# EAGLE design Circuit_Schematicv2 (EAGLE 8.1.0)
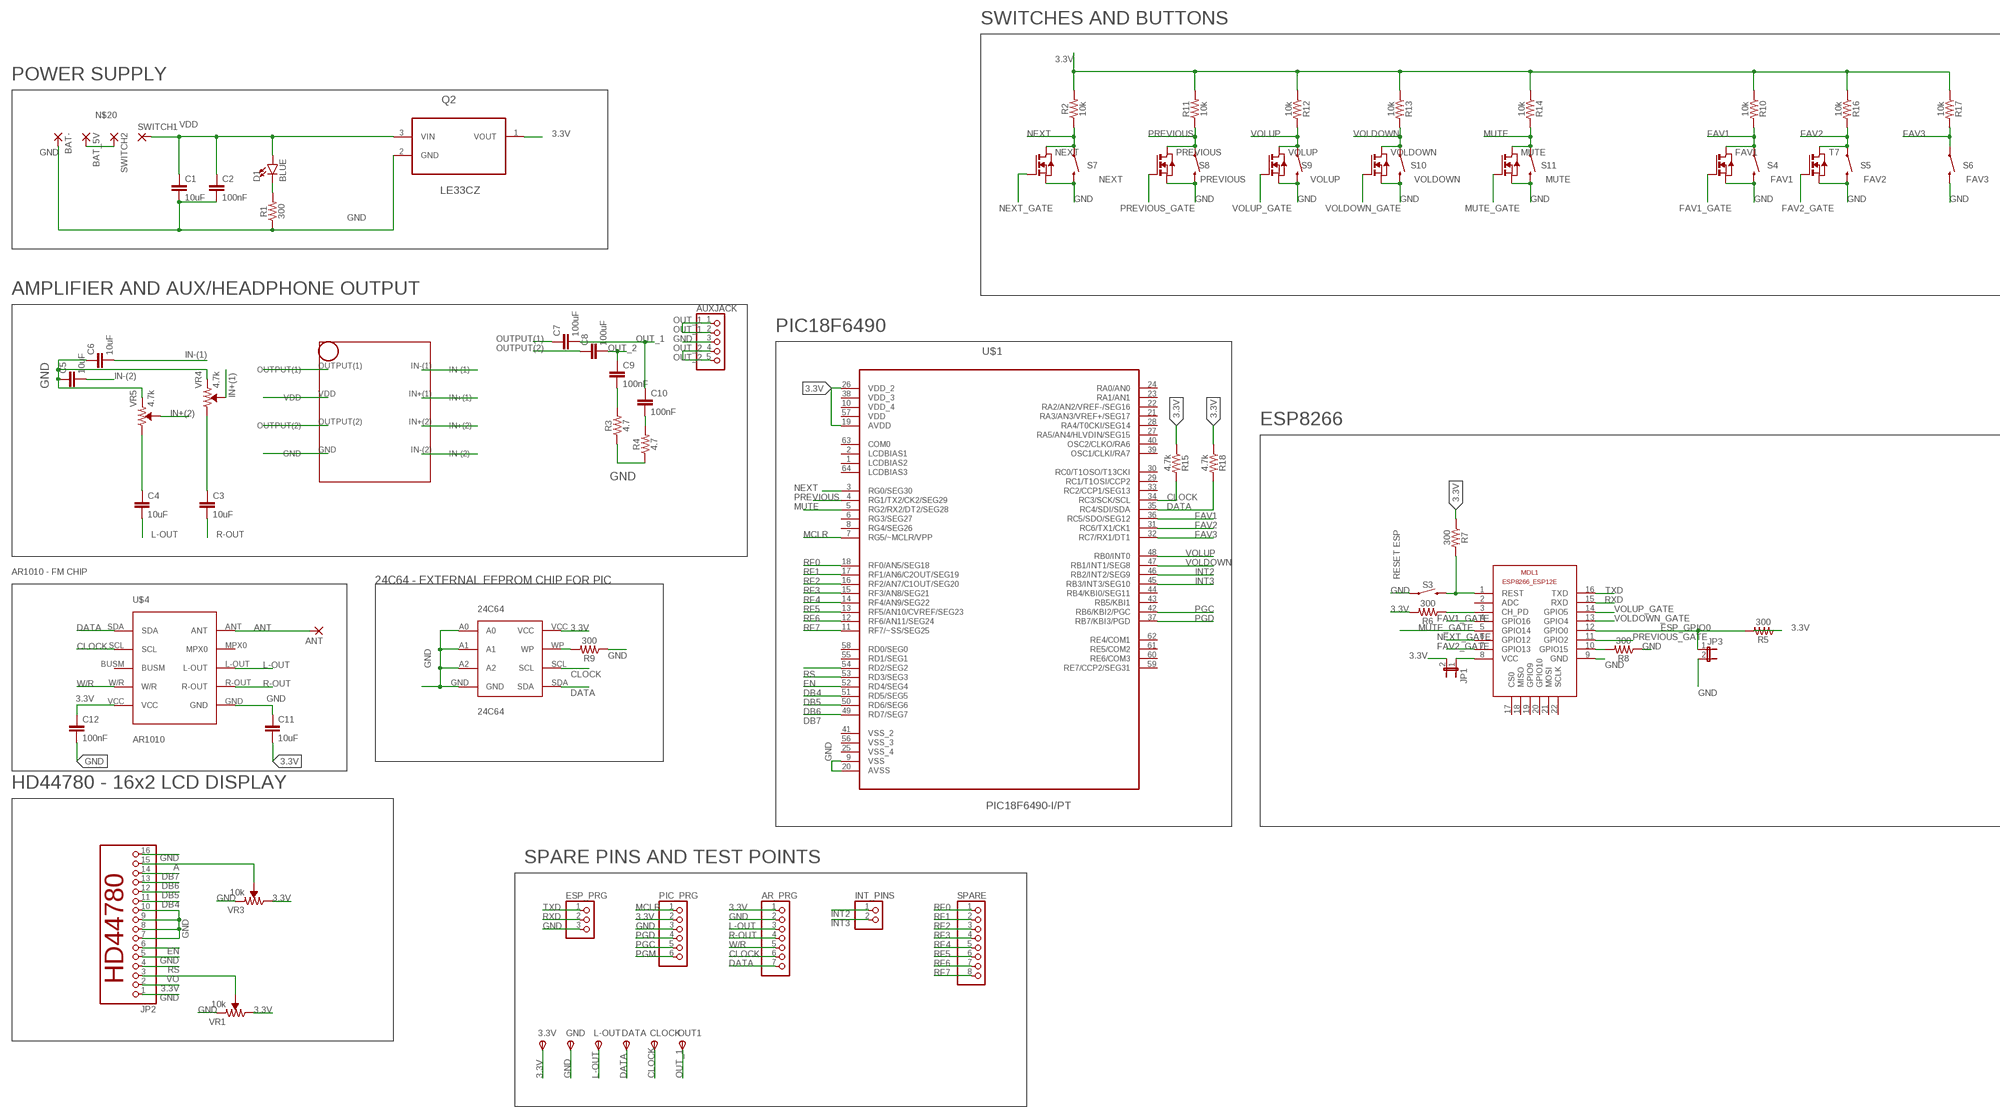
[diagram p0: schematic, sheet 1, part 1 of 2]
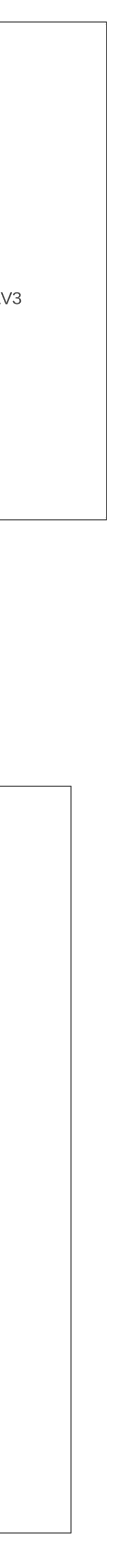
[diagram p1: schematic, sheet 1, part 2 of 2]

## Parts
3.3V  TPSPAD1-13  [P1-13]
24C64  24C64  [SOIC-8]
ANT  2,15/1,0  [2,15/1,0]
AR_PRG  PINHD-1X7  [1X07]
AUXJACK  PINHD-1X5  [1X05]
BAT-  2,15/1,0  [2,15/1,0]
BAT_5V  2,15/1,0  [2,15/1,0]
C1  10uF  10UF-1210-50V-20%  [1210]
C2  100nF  10UF-1210-50V-20%  [1210]
C3  10uF  10UF-1210-50V-20%  [1210]
C4  10uF  10UF-1210-50V-20%  [1210]
C5  10uF  10UF-1210-50V-20%  [1210]
C6  10uF  10UF-1210-50V-20%  [1210]
C7  100uF  10UF-1210-50V-20%  [1210]
C8  100uF  10UF-1210-50V-20%  [1210]
C9  100nF  10UF-1210-50V-20%  [1210]
C10  100nF  10UF-1210-50V-20%  [1210]
C11  10uF  10UF-1210-50V-20%  [1210]
C12  100nF  10UF-1210-50V-20%  [1210]
CLOCK  TPSPAD1-13  [P1-13]
D1  BLUE  LED-BLUE1206  [LED-1206]
DATA  TPSPAD1-13  [P1-13]
ESP_PRG  PINHD-1X3  [1X03]
FAV1  NMOSSOT223  [SOT223]
GND  TPSPAD1-13  [P1-13]
INT_PINS  PINHD-1X2  [1X02]
JP1  JP1E  [JP1]
JP2  LCD16X2HEADER  [LCD16X2HEADER]
JP3  JP1E  [JP1]
L-OUT  TPSPAD1-13  [P1-13]
MDL1  ESP8266-12EESP8266-ESP12E  [ESP8266-ESP12E]
MUTE  NMOSSOT223  [SOT223]
NEXT  NMOSSOT223  [SOT223]
OUT1  TPSPAD1-13  [P1-13]
PIC_PRG  PINHD-1X6  [1X06]
PREVIOUS  NMOSSOT223  [SOT223]
Q2  LE33CZ  [TO127P254X749-3]
R1  300  1OHM-0603-1/10W-1%  [0603]
R2  10k  10KOHM-0603-1/10W-1%  [0603]
R3  4.7  1OHM-0603-1/10W-1%  [0603]
R4  4.7  1OHM-0603-1/10W-1%  [0603]
R5  300  1OHM-0603-1/10W-1%  [0603]
R6  300  1OHM-0603-1/10W-1%  [0603]
R7  300  1OHM-0603-1/10W-1%  [0603]
R8  300  1OHM-0603-1/10W-1%  [0603]
R9  300  1OHM-0603-1/10W-1%  [0603]
R10  10k  10KOHM-0603-1/10W-1%  [0603]
R11  10k  10KOHM-0603-1/10W-1%  [0603]
R12  10k  10KOHM-0603-1/10W-1%  [0603]
R13  10k  10KOHM-0603-1/10W-1%  [0603]
R14  10k  10KOHM-0603-1/10W-1%  [0603]
R15  4.7k  1OHM-0603-1/10W-1%  [0603]
R16  10k  10KOHM-0603-1/10W-1%  [0603]
R17  10k  10KOHM-0603-1/10W-1%  [0603]
R18  4.7k  1OHM-0603-1/10W-1%  [0603]
S3  RESET ESP  MOMENTARY-SWITCH-SPST-SMD-6.0X3.5MM  [TACTILE_SWITCH_SMD_6.0X3.5MM]
S4  FAV1  MOMENTARY-SWITCH-SPST-PTH-6.0MM-KIT  [TACTILE_SWITCH_PTH_6.0MM_KIT]
S5  FAV2  MOMENTARY-SWITCH-SPST-PTH-6.0MM-KIT  [TACTILE_SWITCH_PTH_6.0MM_KIT]
S6  FAV3  MOMENTARY-SWITCH-SPST-PTH-6.0MM-KIT  [TACTILE_SWITCH_PTH_6.0MM_KIT]
S7  NEXT  MOMENTARY-SWITCH-SPST-PTH-6.0MM-KIT  [TACTILE_SWITCH_PTH_6.0MM_KIT]
S8  PREVIOUS  MOMENTARY-SWITCH-SPST-PTH-6.0MM-KIT  [TACTILE_SWITCH_PTH_6.0MM_KIT]
S9  VOLUP  MOMENTARY-SWITCH-SPST-PTH-6.0MM-KIT  [TACTILE_SWITCH_PTH_6.0MM_KIT]
S10  VOLDOWN  MOMENTARY-SWITCH-SPST-PTH-6.0MM-KIT  [TACTILE_SWITCH_PTH_6.0MM_KIT]
S11  MUTE  MOMENTARY-SWITCH-SPST-PTH-6.0MM-KIT  [TACTILE_SWITCH_PTH_6.0MM_KIT]
SPARE  PINHD-1X8  [1X08]
SWITCH1  2,15/1,0  [2,15/1,0]
SWITCH2  2,15/1,0  [2,15/1,0]
T7  NMOSSOT223  [SOT223]
U$1  PIC18F6490-I/PT  [QFP50P1200X1200X120-64N]
U$2  TDA2822M  [TDA2822M]
U$4  AR1010  [AR1010]
VOLDOWN  NMOSSOT223  [SOT223]
VOLUP  NMOSSOT223  [SOT223]
VR1  10k  TRIMPOT-SMD-3MM-OPEN-1/10W-25%  [TRIMPOT-SMD-TC33X]
VR3  10k  TRIMPOT-SMD-3MM-OPEN-1/10W-25%  [TRIMPOT-SMD-TC33X]
VR4  4.7k  TRIMPOT-SMD-3MM-OPEN-1/10W-25%  [TRIMPOT-SMD-TC33X]
VR5  4.7k  TRIMPOT-SMD-3MM-OPEN-1/10W-25%  [TRIMPOT-SMD-TC33X]

## Nets
3.3V: 3.3V.TP(PP) 24C64.VCC AR_PRG.1 C11.2 C12.1 JP1.2 JP2.2 PIC_PRG.2 Q2.1(VOUT) R2.2 R5.1 R6.2 R7.1 R10.1 R11.2 R12.1 R13.1 R14.1 R15.1 R16.1 R17.1 R18.1 U$1.19(AVDD) U$1.26(VDD_2) U$4.VCC VR1.1(CW) VR3.1(CW)
A: JP2.15 VR3.2(WIPER)
ANT: ANT.1(P) U$4.ANT
CH_PD: MDL1.3(CH_PD) R6.1
CLOCK: 24C64.SCL AR_PRG.6 CLOCK.TP(PP) R15.2 U$1.34(RC3/SCK/SCL) U$4.SCL
DATA: 24C64.SDA AR_PRG.7 DATA.TP(PP) R18.2 U$1.35(RC4/SDI/SDA) U$4.SDA
DB4: JP2.11 U$1.52(RD4/SEG4)
DB5: JP2.12 U$1.51(RD5/SEG5)
DB6: JP2.13 U$1.50(RD6/SEG6)
DB7: JP2.14 U$1.49(RD7/SEG7)
EN: JP2.6 U$1.53(RD3/SEG3)
ESP_GPIO0: JP3.1 MDL1.12(GPIO0) R5.2
ESP_VCC: JP1.1 MDL1.8(VCC)
FAV1: FAV1.2(D) FAV1.4(D) R10.2 S4.1 U$1.36(RC5/SDO/SEG12)
FAV1_GATE: FAV1.1(G) MDL1.4(GPIO16)
FAV2: R16.2 S5.1 T7.2(D) T7.4(D) U$1.31(RC6/TX1/CK1)
FAV2_GATE: MDL1.7(GPIO13) T7.1(G)
FAV3: R17.2 S6.1 U$1.32(RC7/RX1/DT1)
GND: 24C64.A0 24C64.A1 24C64.A2 24C64.GND AR_PRG.2 AUXJACK.3 BAT-.1(P) C1.2 C2.2 C5.1 C6.1 C11.1 C12.2 ESP_PRG.3 FAV1.3(S) GND.TP(PP) JP2.1 JP2.5 JP2.7 JP2.8 JP2.9 JP2.10 JP2.16 JP3.2 MDL1.9(GND) MUTE.3(S) NEXT.3(S) PIC_PRG.3 PREVIOUS.3(S) Q2.2(GND) R1.1 R3.1 R4.1 R8.1 R9.1 S3.1 S4.3 S5.3 S6.3 S7.3 S8.3 S9.3 S10.3 S11.3 T7.3(S) U$1.9(VSS) U$1.20(AVSS) U$2.GND U$4.GND VOLDOWN.3(S) VOLUP.3(S) VR1.3(CCW) VR3.3(CCW) VR4.3(CCW) VR5.3(CCW)
IN+(1): U$2.IN+(1) VR4.2(WIPER)
IN+(2): U$2.IN+(2) VR5.2(WIPER)
IN-(1): C6.2 U$2.IN-(1)
IN-(2): C5.2 U$2.IN-(2)
INT2: INT_PINS.1 U$1.46(RB2/INT2/SEG9)
INT3: INT_PINS.2 U$1.45(RB3/INT3/SEG10)
L-OUT: AR_PRG.3 C4.2 L-OUT.TP(PP) U$4.L-OUT
MCLR: PIC_PRG.1 U$1.7(RG5/~MCLR/VPP)
MUTE: MUTE.2(D) MUTE.4(D) R14.2 S11.1 U$1.5(RG2/RX2/DT2/SEG28)
MUTE_GATE: MDL1.5(GPIO14) MUTE.1(G)
N$6: C10.2 R4.2
N$10: 24C64.WP R9.2
N$11: C4.1 VR5.1(CW)
N$12: C3.1 VR4.1(CW)
N$17: C9.2 R3.2
N$18: D1.C R1.2
N$20: BAT_5V.1(P) SWITCH2.1(P)
N$24: MDL1.10(GPIO15) R8.2
NEXT: NEXT.2(D) NEXT.4(D) R2.1 S7.1 U$1.3(RG0/SEG30)
NEXT_GATE: MDL1.6(GPIO12) NEXT.1(G)
OUT_1: AUXJACK.1 AUXJACK.2 C7.2 C10.1 OUT1.TP(PP)
OUT_2: AUXJACK.4 AUXJACK.5 C8.2 C9.1
OUTPUT(1): C7.1 U$2.OUTPUT(1)
OUTPUT(2): C8.1 U$2.OUTPUT(2)
PGC: PIC_PRG.5 U$1.42(RB6/KBI2/PGC)
PGD: PIC_PRG.4 U$1.37(RB7/KBI3/PGD)
PGM: PIC_PRG.6
PREVIOUS: PREVIOUS.2(D) PREVIOUS.4(D) R11.1 S8.1 U$1.4(RG1/TX2/CK2/SEG29)
PREVIOUS_GATE: MDL1.11(GPIO2) PREVIOUS.1(G)
R-OUT: AR_PRG.4 C3.2 U$4.R-OUT
REST: MDL1.1(REST) R7.2 S3.2
RF0: SPARE.1 U$1.18(RF0/AN5/SEG18)
RF1: SPARE.2 U$1.17(RF1/AN6/C2OUT/SEG19)
RF2: SPARE.3 U$1.16(RF2/AN7/C1OUT/SEG20)
RF3: SPARE.4 U$1.15(RF3/AN8/SEG21)
RF4: SPARE.5 U$1.14(RF4/AN9/SEG22)
RF5: SPARE.6 U$1.13(RF5/AN10/CVREF/SEG23)
RF6: SPARE.7 U$1.12(RF6/AN11/SEG24)
RF7: SPARE.8 U$1.11(RF7/~SS/SEG25)
RS: JP2.4 U$1.54(RD2/SEG2)
RXD: ESP_PRG.2 MDL1.15(RXD)
TXD: ESP_PRG.1 MDL1.16(TXD)
VDD: C1.1 C2.1 D1.A Q2.3(VIN) SWITCH1.1(P) U$2.VDD
VO: JP2.3 VR1.2(WIPER)
VOLDOWN: R13.2 S10.1 U$1.47(RB1/INT1/SEG8) VOLDOWN.2(D) VOLDOWN.4(D)
VOLDOWN_GATE: MDL1.13(GPIO4) VOLDOWN.1(G)
VOLUP: R12.2 S9.1 U$1.48(RB0/INT0) VOLUP.2(D) VOLUP.4(D)
VOLUP_GATE: MDL1.14(GPIO5) VOLUP.1(G)
W/R: AR_PRG.5 U$4.W/R
Unconnected: MDL1.2(ADC) MDL1.17(CS0) MDL1.18(MISO) MDL1.19(GPIO9) MDL1.20(GPIO10) MDL1.21(MOSI) MDL1.22(SCLK) U$1.1(LCDBIAS2) U$1.2(LCDBIAS1) U$1.6(RG3/SEG27) U$1.8(RG4/SEG26) U$1.21(RA3/AN3/VREF+/SEG17) U$1.22(RA2/AN2/VREF-/SEG16) U$1.23(RA1/AN1) U$1.24(RA0/AN0) U$1.27(RA5/AN4/HLVDIN/SEG15) U$1.28(RA4/T0CKI/SEG14) U$1.29(RC1/T1OSI/CCP2) U$1.30(RC0/T1OSO/T13CKI) U$1.33(RC2/CCP1/SEG13) U$1.39(OSC1/CLKI/RA7) U$1.40(OSC2/CLKO/RA6) U$1.43(RB5/KBI1) U$1.44(RB4/KBI0/SEG11) U$1.55(RD1/SEG1) U$1.58(RD0/SEG0) U$1.59(RE7/CCP2/SEG31) U$1.60(RE6/COM3) U$1.61(RE5/COM2) U$1.62(RE4/COM1) U$1.63(COM0) U$1.64(LCDBIAS3) U$4.BUSM U$4.MPX0

## Notes on the sheet
- SWITCHES AND BUTTONS
- POWER SUPPLY
- AMPLIFIER AND AUX/HEADPHONE OUTPUT
- PIC18F6490
- ESP8266
- AR1010 - FM CHIP
- 24C64 - EXTERNAL EEPROM CHIP FOR PIC
- HD44780 - 16x2 LCD DISPLAY
- SPARE PINS AND TEST POINTS

## Power pins joined to a net without a drawn wire
VDD: U$1.57(VDD)
VDD_3: U$1.38(VDD_3)
VDD_4: U$1.10(VDD_4)
VSS_2: U$1.41(VSS_2)
VSS_3: U$1.56(VSS_3)
VSS_4: U$1.25(VSS_4)

## Library data of the parts
3.3V CLOCK DATA GND L-OUT OUT1 = testpad:TPS: TEST PIN
24C64 = MIRO:24C64
ANT BAT- BAT_5V SWITCH1 SWITCH2 = wirepad:2,15/1,0: THROUGH-HOLE PAD
AR_PRG = pinhead:PINHD-1X7: PIN HEADER
AUXJACK = pinhead:PINHD-1X5: PIN HEADER
C1 C3-C6 C11 = SparkFun-Capacitors:10UF: 10.0µF ceramic capacitors A capacitor is a passive two-terminal electrical component used to store electrical energy temporarily in an electric field.; PROD_ID: CAP-09824
C2 C7-C10 C12 = SparkFun-Capacitors:10UF: 10.0µF ceramic capacitors A capacitor is a passive two-terminal electrical component used to store electrical energy temporarily in an electric field.; PROD_ID: CAP-09824; VALUE: 10uF
D1 = SparkFun-LED:LED-BLUE: Blue SMD LED Used in manufacturing of various products at SparkFun Packages: 0603 - SMD 0603 package [Product Link] <http://www.digikey.com/product-detail/en/SMLE12BC7TT86/511-1589-2-ND/1641808> 1206 - SMD1206 package [Product Link] <http://www.digikey.com/product-detail/en/lite-on-inc/LTST-C150TBKT/160-1643-1-ND/573584> SparkFun Products: ESP8266 Thing-Dev Board <https://www.sparkfun.com/products/13711> RedBoard <https://www.sparkfun.com/products/12757>; PROD_ID: DIO-09911
ESP_PRG = pinhead:PINHD-1X3: PIN HEADER
FAV1 MUTE NEXT PREVIOUS T7 VOLDOWN VOLUP = zetex:NMOSSOT223: MOS FET; OC_FARNELL: unknown; OC_NEWARK: unknown
INT_PINS = pinhead:PINHD-1X2: PIN HEADER
JP1 JP3 = jumper:JP1E: JUMPER
JP2 = MIRO:LCD16X2HEADER: PIN HEADER
MDL1 = ESP8266-12E:ESP8266-12E: ESP8266-12E with additional I/O and GPIO04/05 corrected The author cannot warrant that this library is free from error or will meet your specific requirements. Created by PuceBaboon.com. Komagane, Nagano, JAPAN
PIC_PRG = pinhead:PINHD-1X6: PIN HEADER
Q2 = ST Microelctronics_By_element14_Batch_1:LE33CZ: VOLTAGE REGULATORS; MPN: LE33CZ; OC_FARNELL: 9755349; OC_NEWARK: 26M0166; PACKAGE: TO-92; SUPPLIER: STMICROELECTRONICS
R1 R3-R9 R15 R18 = SparkFun-Resistors:1OHM: 1Ω resistor A resistor is a passive two-terminal electrical component that implements electrical resistance as a circuit element. Resistors act to reduce current flow, and, at the same time, act to lower voltage levels within circuits. - Wikipedia; PROD_ID: RES-08269; VALUE: 1
R2 R10-R14 R16 R17 = SparkFun-Resistors:10KOHM: 10kΩ resistor A resistor is a passive two-terminal electrical component that implements electrical resistance as a circuit element. Resistors act to reduce current flow, and, at the same time, act to lower voltage levels within circuits. - Wikipedia; PROD_ID: RES-00824
S3 = SparkFun-Switches:MOMENTARY-SWITCH-SPST: Momentary Switch (Pushbutton) - SPST Normally-open (NO) SPST momentary switches (buttons, pushbuttons). Variants PTH-12MM - 12mm square, through-hole Momentary Pushbutton Switch - 12mm Square <https://www.sparkfun.com/products/9190> (COM-09190) PTH-6.0MM, PTH-6.0MM-KIT - 6.0mm square, through-hole Mini Pushbutton Switch <https://www.sparkfun.com/products/97> (COM-00097) KIT package intended for soldering kit's - only one side of pads' copper is exposed. PTH-RIGHT-ANGLE-KIT - Right-angle, through-hole Right Angle Tactile Button <https://www.sparkfun.com/products/10791> - Used on SparkFun BigTime Watch Kit <https://www.sparkfun.com/products/11734> SMD-12MM - 12mm square, surface-mount Tactile Button - SMD (12mm) <https://www.sparkfun.com/products/12993> (COM-12993) Used on SparkFun PicoBoard <https://www.sparkfun.com/products/11888> SMD-4.5MM - 4.5mm Square Trackball Switch Used on SparkFun Blackberry Trackballer Breakout <https://www.sparkfun.com/products/13169> SMD-4.6MMX2.8MM - 4.60mm x 2.80mm, surface mount Used on SparkFun SAMD21 Mini Breakout <https://www.sparkfun.com/products/13664> SMD-5.2MM, SMD-5.2-REDUNDANT - 5.2mm square, surface-mount Mini Pushbutton Switch - SMD <https://www.sparkfun.com/products/8720> (COM-08720) Used on Arduino Pro Mini <https://www.sparkfun.com/products/11114> REDUNDANT package connects both switch circuits together SMD-6.0X3.5MM - 6.0 x 3.5mm, surface mount Momentary Reset Switch SMD <https://www.sparkfun.com/products/8229> (COM-08229) SMD-6.2MM-TALL - 6.2mm square, surface mount Tactile Button - SMD (6mm) <https://www.sparkfun.com/products/12992> Used on SparkFun Digital Sandbox <https://www.sparkfun.com/products/12651> SMD-RIGHT-ANGLE - Right-angle, surface mount Used on SparkFun Block for Intel® Edison - Arduino <https://www.sparkfun.com/products/13036>; PROD_ID: SWCH-00815; SF_SKU: COM-08229
S4-S11 = SparkFun-Switches:MOMENTARY-SWITCH-SPST: Momentary Switch (Pushbutton) - SPST Normally-open (NO) SPST momentary switches (buttons, pushbuttons). Variants PTH-12MM - 12mm square, through-hole Momentary Pushbutton Switch - 12mm Square <https://www.sparkfun.com/products/9190> (COM-09190) PTH-6.0MM, PTH-6.0MM-KIT - 6.0mm square, through-hole Mini Pushbutton Switch <https://www.sparkfun.com/products/97> (COM-00097) KIT package intended for soldering kit's - only one side of pads' copper is exposed. PTH-RIGHT-ANGLE-KIT - Right-angle, through-hole Right Angle Tactile Button <https://www.sparkfun.com/products/10791> - Used on SparkFun BigTime Watch Kit <https://www.sparkfun.com/products/11734> SMD-12MM - 12mm square, surface-mount Tactile Button - SMD (12mm) <https://www.sparkfun.com/products/12993> (COM-12993) Used on SparkFun PicoBoard <https://www.sparkfun.com/products/11888> SMD-4.5MM - 4.5mm Square Trackball Switch Used on SparkFun Blackberry Trackballer Breakout <https://www.sparkfun.com/products/13169> SMD-4.6MMX2.8MM - 4.60mm x 2.80mm, surface mount Used on SparkFun SAMD21 Mini Breakout <https://www.sparkfun.com/products/13664> SMD-5.2MM, SMD-5.2-REDUNDANT - 5.2mm square, surface-mount Mini Pushbutton Switch - SMD <https://www.sparkfun.com/products/8720> (COM-08720) Used on Arduino Pro Mini <https://www.sparkfun.com/products/11114> REDUNDANT package connects both switch circuits together SMD-6.0X3.5MM - 6.0 x 3.5mm, surface mount Momentary Reset Switch SMD <https://www.sparkfun.com/products/8229> (COM-08229) SMD-6.2MM-TALL - 6.2mm square, surface mount Tactile Button - SMD (6mm) <https://www.sparkfun.com/products/12992> Used on SparkFun Digital Sandbox <https://www.sparkfun.com/products/12651> SMD-RIGHT-ANGLE - Right-angle, surface mount Used on SparkFun Block for Intel® Edison - Arduino <https://www.sparkfun.com/products/13036>; PROD_ID: SWCH-08441; SF_SKU: COM-00097
SPARE = pinhead:PINHD-1X8: PIN HEADER
U$1 = Microchip_By_element14_Batch_1:PIC18F6490-I/PT: IC PIC MCU; MPN: PIC18F6490-I/PT; OC_FARNELL: 1332278; OC_NEWARK: 08J9646; PACKAGE: QFP-64; SUPPLIER: Microchip
U$2 = smd-footprints:TDA2822M
U$4 = MIRO:AR1010
VR1 VR3 = SparkFun-Resistors:TRIMPOT: Trimming Potentiometer (Trimpot) Three-terminal potentiometers, with an adjustable wiper and two adjustable resistors. A pot can be used to create a configurable voltage divider, or as a variable resistor. "Trimpots" are a subset of potentiometers, usually intended for "set-and-forget" applications. They're often more delicate than standard potentiometers - rated for fewer turns. Variants PTH-KNOB - PTH Trimpot w/ finger-adjustable knob Trimpot 10K with Knob <https://www.sparkfun.com/products/9806> (COM-09806) Datasheet <http://www.sparkfun.com/datasheets/Components/General/TSR-3386.pdf> SMD-3MM-CLOSED-FRAME - SMD 3mm Square Closed-Frame Trimpot Used on e.g. EasyDriver - Stepper Motor Driver <https://www.sparkfun.com/products/12779> Datasheet <http://www.bitechnologies.com/pdfs/22.pdf> (22AR10KTR) SMD-5MM - SMD 5mm Square Closed-Frame Trimpot Used on e.g. IOIO-OTG - V2.2 <https://www.sparkfun.com/products/13613> Datasheet <http://www.vishay.com/docs/51008/ts53.pdf> (TS53YL502MR10) SMD-3MM-1/10W-25% - 3mm Square Open-Frame Trimpot Used on e.g. SparkFun Shapeoko <https://www.sparkfun.com/products/13899> Datasheet <http://www.bourns.com/docs/Product-Datasheets/TC33.pdf> (TC33X-2-103E); PROD_ID: RES-12428
VR4 VR5 = SparkFun-Resistors:TRIMPOT: Trimming Potentiometer (Trimpot) Three-terminal potentiometers, with an adjustable wiper and two adjustable resistors. A pot can be used to create a configurable voltage divider, or as a variable resistor. "Trimpots" are a subset of potentiometers, usually intended for "set-and-forget" applications. They're often more delicate than standard potentiometers - rated for fewer turns. Variants PTH-KNOB - PTH Trimpot w/ finger-adjustable knob Trimpot 10K with Knob <https://www.sparkfun.com/products/9806> (COM-09806) Datasheet <http://www.sparkfun.com/datasheets/Components/General/TSR-3386.pdf> SMD-3MM-CLOSED-FRAME - SMD 3mm Square Closed-Frame Trimpot Used on e.g. EasyDriver - Stepper Motor Driver <https://www.sparkfun.com/products/12779> Datasheet <http://www.bitechnologies.com/pdfs/22.pdf> (22AR10KTR) SMD-5MM - SMD 5mm Square Closed-Frame Trimpot Used on e.g. IOIO-OTG - V2.2 <https://www.sparkfun.com/products/13613> Datasheet <http://www.vishay.com/docs/51008/ts53.pdf> (TS53YL502MR10) SMD-3MM-1/10W-25% - 3mm Square Open-Frame Trimpot Used on e.g. SparkFun Shapeoko <https://www.sparkfun.com/products/13899> Datasheet <http://www.bourns.com/docs/Product-Datasheets/TC33.pdf> (TC33X-2-103E); PROD_ID: RES-12428; VALUE: 10k

## Board
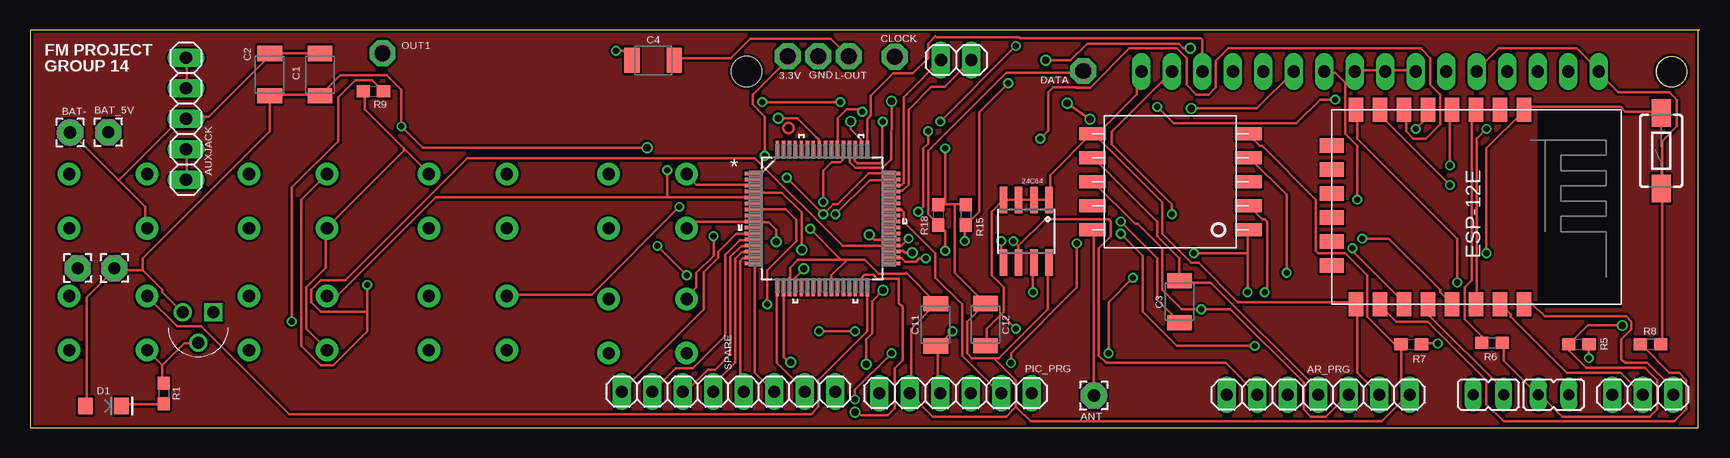
[diagram p2: board, top side]
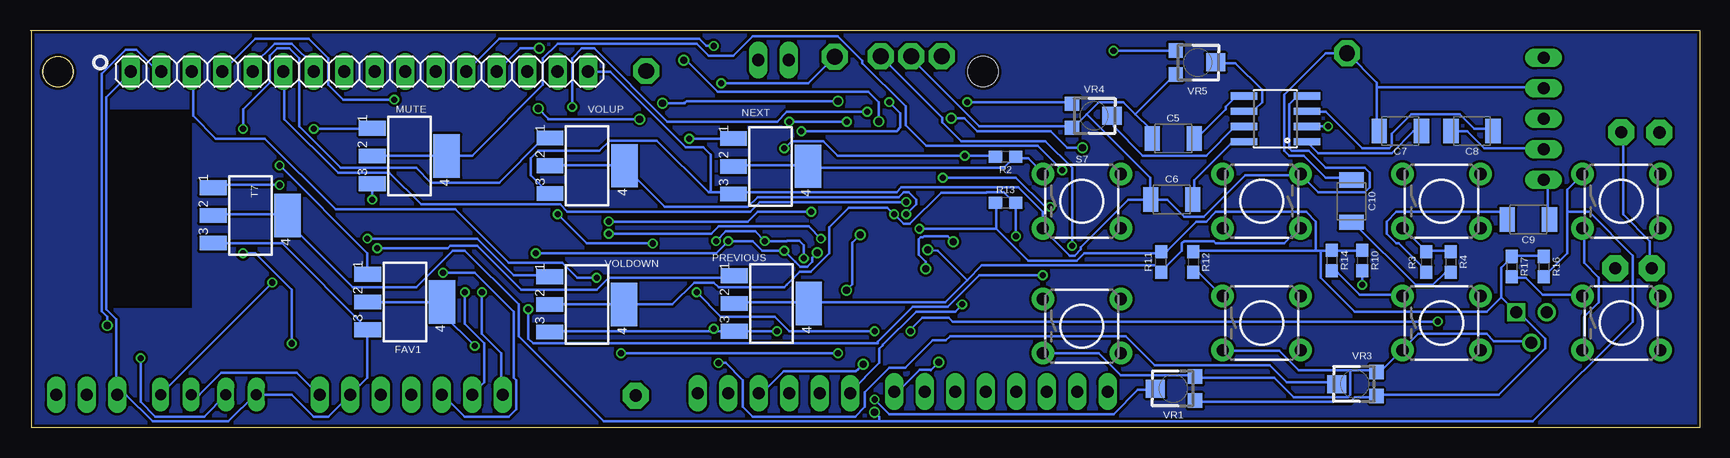
[diagram p3: board, bottom side, seen from below]

Size 139.13 x 33.15 mm. Coordinates in mm from the lower left corner, seen from the top.
Outline: 139,33.15 139,0 0,0 0,33.15 139,33.15
Outline: 139.13,33.15 139,33.15
Outline: circle at 136.8,29.66 radius 1.25
Copper layers (1*16): Top 0.035mm / dielectric 1.5mm / Bottom 0.035mm
Design rules "SeeedStudio_2layer_DRU_no_angle_20140221 *": minimum track width 8mil, minimum drill 20mil, track to track 8mil, track to pad 8mil, pad to pad 8mil, via to via 8mil, smd to smd 0mil, copper to edge 10mil, drill to drill 10mil, minimum pad ring 10mil, minimum via ring 6mil, stop-mask expansion 2mil, vias tented up to drill 100mil, thermal gap 10mil
Holes 2.5 mm at 59.7,29.68 136.79,29.66

### Footprints (pad centres in the part's own frame; a part is rotated, then mirrored left to right if it is on the bottom)
P1-13 = drill 1.321 pad 2.159 octagon: TP 0,0
SOIC-8 = smd 0.61 x 2.21: A0 -1.905,-2.616; A1 -0.635,-2.616; A2 0.635,-2.616; GND 1.905,-2.616; SCL 0.635,2.616; SDA 1.905,2.616; VCC -1.905,2.616; WP -0.635,2.616
2,15/1,0 = drill 1.016 pad 2.159 octagon: 1 0,0
1X07 = drill 1.016 long: 1 -7.62,0; 2 -5.08,0; 3 -2.54,0; 4 0,0; 5 2.54,0; 6 5.08,0; 7 7.62,0
1X05 = drill 1.016 long: 1 -5.08,0; 2 -2.54,0; 3 0,0; 4 2.54,0; 5 5.08,0
1210 = smd 1.27 x 2.06: 1 -1.755,0; 2 1.755,0
LED-1206 = smd 1.2 x 1.4: A -1.5,0; C 1.5,0
1X03 = drill 1.016 long: 1 -2.54,0; 2 0,0; 3 2.54,0
SOT223 = smd 1.219 x 2.235: 1 -2.311,-3.099; 2 0,-3.099; 3 2.311,-3.099 | smd 3.6 x 2.2: 4 0,3.099
1X02 = drill 1.016 long: 1 -1.27,0; 2 1.27,0
JP1 = drill 0.914 long: 1 0,-1.27; 2 0,1.27
LCD16X2HEADER = drill 1.016 long: 1 -19.05,0; 2 -16.51,0; 3 -13.97,0; 4 -11.43,0; 5 -8.89,0; 6 -6.35,0; 7 -3.81,0; 8 -1.27,0; 9 1.27,0; 10 3.81,0; 11 6.35,0; 12 8.89,0; 13 11.43,0; 14 13.97,0; 15 16.51,0; 16 19.05,0
ESP8266-ESP12E = smd 2 x 1.2: 1 -7.62,5.84; 2 -7.62,3.84; 3 -7.62,1.84; 4 -7.62,-0.16; 5 -7.62,-2.16; 6 -7.62,-4.16; 7 -7.62,-6.16; 8 -7.62,-8.16; 9 8.58,-8.16; 10 8.58,-6.16; 11 8.58,-4.16; 12 8.58,-2.16; 13 8.58,-0.16; 14 8.58,1.84; 15 8.58,3.84; 16 8.58,5.84 | smd 1.2 x 2: 17 -4.62,-10.16; 18 -2.62,-10.16; 19 -0.62,-10.16; 20 1.38,-10.16; 21 3.38,-10.16; 22 5.38,-10.16
1X06 = drill 1.016 long: 1 -6.35,0; 2 -3.81,0; 3 -1.27,0; 4 1.27,0; 5 3.81,0; 6 6.35,0
TO127P254X749-3 = drill 0.991 square: 1 -2.54,-2.54 | drill 0.991: 2 -1.27,0; 3 0,-2.54
0603 = smd 1.1 x 1: 1 -0.85,0; 2 0.85,0
TACTILE_SWITCH_SMD_6.0X3.5MM = smd 2.3 x 1.6: 1 -3.15,0; 2 3.15,0
TACTILE_SWITCH_PTH_6.0MM_KIT = drill 1.016 pad 1.88: 1 -3.251,2.261; 2 3.251,2.261; 3 -3.251,-2.261; 4 3.251,-2.261
1X08 = drill 1.016 long: 1 -8.89,0; 2 -6.35,0; 3 -3.81,0; 4 -1.27,0; 5 1.27,0; 6 3.81,0; 7 6.35,0; 8 8.89,0
QFP50P1200X1200X120-64N = smd 1.473 x 0.279: 1 -5.74,3.759; 2 -5.74,3.251; 3 -5.74,2.743; 4 -5.74,2.261; 5 -5.74,1.753; 6 -5.74,1.245; 7 -5.74,0.762; 8 -5.74,0.254; 9 -5.74,-0.254; 10 -5.74,-0.762; 11 -5.74,-1.245; 12 -5.74,-1.753; 13 -5.74,-2.261; 14 -5.74,-2.743; 15 -5.74,-3.251; 16 -5.74,-3.759; 33 5.74,-3.759; 34 5.74,-3.251; 35 5.74,-2.743; 36 5.74,-2.261; 37 5.74,-1.753; 38 5.74,-1.245; 39 5.74,-0.762; 40 5.74,-0.254; 41 5.74,0.254; 42 5.74,0.762; 43 5.74,1.245; 44 5.74,1.753; 45 5.74,2.261; 46 5.74,2.743; 47 5.74,3.251; 48 5.74,3.759 | smd 0.279 x 1.473: 17 -3.759,-5.74; 18 -3.251,-5.74; 19 -2.743,-5.74; 20 -2.261,-5.74; 21 -1.753,-5.74; 22 -1.245,-5.74; 23 -0.762,-5.74; 24 -0.254,-5.74; 25 0.254,-5.74; 26 0.762,-5.74; 27 1.245,-5.74; 28 1.753,-5.74; 29 2.261,-5.74; 30 2.743,-5.74; 31 3.251,-5.74; 32 3.759,-5.74; 49 3.759,5.74; 50 3.251,5.74; 51 2.743,5.74; 52 2.261,5.74; 53 1.753,5.74; 54 1.245,5.74; 55 0.762,5.74; 56 0.254,5.74; 57 -0.254,5.74; 58 -0.762,5.74; 59 -1.245,5.74; 60 -1.753,5.74; 61 -2.261,5.74; 62 -2.743,5.74; 63 -3.251,5.74; 64 -3.759,5.74
TDA2822M = smd 0.61 x 2.21: GND 1.905,-2.616; IN+(1) -0.635,2.616; IN+(2) 0.635,2.616; IN-(1) -1.905,2.616; IN-(2) 1.905,2.616; OUTPUT(1) -1.905,-2.616; OUTPUT(2) 0.635,-2.616; VDD -0.635,-2.616
AR1010 = smd 2.184 x 1.067: ANT 10,1.5; BUSM -3,-2.5; GND 10,-6.5; L-OUT 10,-2.5; MPX0 10,-0.5; R-OUT 10,-4.5; SCL -3,-0.5; SDA -3,1.5; VCC -3,-6.5; W/R -3,-4.5
TRIMPOT-SMD-TC33X = smd 1.2 x 1.2: 1 -1,-1.825; 3 1,-1.825 | smd 1.5 x 1.6: 2 0,1.5

### Placement (x,y rotation side)
3.3V  63.16,30.95 0 top
24C64  83.02,16.37 180 top
ANT  88.66,2.68 0 top
AR_PRG  107.35,2.76 180 top
AUXJACK  12.99,25.74 270 top
BAT-  3.34,24.6 0 top
BAT_5V  6.52,24.63 0 top
C1  24.17,29.43 90 top
C2  19.98,29.43 90 top
C3  95.8,10.5 90 top
C4  51.93,30.62 0 top
C5  43.85,24.09 0 bottom
C6  43.98,19.01 0 bottom
C7  24.93,24.73 180 bottom
C8  18.96,24.73 180 bottom
C9  14.26,17.36 180 bottom
C10  28.99,18.89 270 bottom
C11  75.48,8.57 90 top
C12  79.62,8.6 270 top
CLOCK  72.07,30.93 0 top
D1  6.11,1.82 0 top
DATA  87.77,29.73 0 top
ESP_PRG  134.41,2.76 180 top
FAV1  107.89,10.48 270 bottom
GND  65.7,30.95 0 top
INT_PINS  77.18,30.65 0 top
JP1  126.96,2.76 90 top
JP2  111.67,29.68 0 bottom
JP3  121.53,2.76 90 top
L-OUT  68.24,30.95 0 top
MDL1  118.66,18.89 270 top
MUTE  107.51,22.65 270 bottom
NEXT  77.41,21.78 270 bottom
OUT1  29.38,31.21 0 top
PIC_PRG  77.13,2.88 0 top
PREVIOUS  77.33,10.35 270 bottom
Q2  12.74,7.08 180 top
R1  11.14,2.86 270 top
R2  57.82,22.57 180 bottom
R3  22.77,13.81 270 bottom
R4  20.74,13.81 270 bottom
R5  129.07,6.95 0 top
R6  121.83,7.08 0 top
R7  115.1,6.95 0 top
R8  135.04,6.95 180 top
R9  28.61,28.03 0 top
R10  28.11,13.93 270 bottom
R11  44.87,13.81 90 bottom
R12  42.2,13.81 270 bottom
R13  57.82,18.76 0 bottom
R14  30.65,13.93 270 bottom
R15  77.97,17.74 270 top
R16  12.99,13.43 270 bottom
R17  15.66,13.43 270 bottom
R18  75.68,17.74 270 top
S3  135.93,23.08 90 top
S4  21.5,18.89 0 bottom
S5  6.52,18.89 0 bottom
S6  6.52,8.73 0 bottom
S7  51.47,18.89 0 bottom
S8  36.49,18.89 180 bottom
S9  36.49,8.73 0 bottom
S10  51.47,8.47 0 bottom
S11  21.5,8.73 0 bottom
SPARE  58.2,3.01 180 top
SWITCH1  7.02,13.3 0 top
SWITCH2  3.98,13.3 0 top
T7  120.77,17.69 270 bottom
U$1  66.03,17.44 0 top
U$2  35.34,25.74 90 bottom
U$4  98.54,18 180 top
VOLDOWN  92.72,10.28 270 bottom
VOLUP  92.7,21.83 270 bottom
VR1  43.85,3.27 90 bottom
VR3  28.74,3.65 90 bottom
VR4  50.46,26 270 bottom
VR5  41.82,30.44 270 bottom

### Tracks (layer width: path | path; a pad name or v marks a point on that pad's centre or on a via)
3.3V  (via drill 0.51, 0.6)
  Top 0.203: R6.2 122.8,7.02 122.8,5.6 125.64,2.76 JP1.2 125.84,2.76 127.67,0.93 134.99,0.93 135.6,1.54 135.6,3.98 134.58,4.99 129.71,4.99 128.28,6.42 128.28,6.82 R5.1 129.8,8.52 v132.7,8.52 | 114.87,2.76 114.26,3.37 114.26,6.82 R7.1 114.06,7.02 113.65,7.02 111.42,9.26 111.42,12.71 109.59,14.54 107.35,14.54 107.15,14.75 107.15,19.01 102.68,23.48 102.48,23.48 101.66,24.3 U$4.VCC | 63.26,12.51 63.26,11.7 U$1.19 63.32,11.74 63.32,12.56 63.34,12.57 63.34,13.35 64,14.01 67.58,14.01 | v61.23,22.67 61.23,25.92 60.21,26.94 60.21,27.75 63.26,30.8 3.3V.TP | 77.08,18.61 77.89,18.61 R15.1 | 77.08,18.61 76.26,18.61 | 76.26,18.61 75.86,18.61 R18.1 | 77.08,18.61 77.08,12.92 79.52,10.48 C12.1 79.52,10.28 78.09,8.85 78.09,6.21 78.5,5.81 80.33,5.81 | 80.33,5.81 80.73,5.81 84.8,9.87 84.8,13.73 24C64.VCC | 76.26,18.61 v76.26,23.28 | 82.16,1.74 81.34,0.93 75.25,0.93 73.42,2.76 PIC_PRG.2 73.42,2.96 73.42,8.24 75.45,10.28 C11.2 75.45,10.48 73.01,12.92 72.94,12.84 70.73,12.84 69.56,14.01 68.11,14.01 | 82.16,1.74 82.16,3.98 80.33,5.81 | 114.87,2.76 112.64,0.52 83.38,0.52 82.16,1.74 | 114.87,2.76 AR_PRG.1 | 66.77,11.7 U$1.26 66.79,12.69 68.11,14.01 | 67.58,14.01 v65.01,16.58 | 68.11,14.01 67.58,14.01
  Bottom 0.203: 58.59,16.58 55.94,13.93 51.88,13.93 51.27,14.54 44.97,14.54 R11.2 44.77,14.75 44.36,14.75 41.92,17.18 41.11,17.18 40.3,18 32.78,18 31.97,17.18 31.97,14.75 | 58.59,16.58 58.59,18.61 R13.1 | VR1.1 41.92,2.15 29.12,2.15 28.72,2.55 27.09,2.55 VR3.1 26.89,2.76 16.73,2.76 12.87,6.62 12.87,7.43 15.1,9.67 Q2.1 15.3,9.67 16.52,10.89 | R16.1 13.07,14.34 15.51,14.34 R17.1 15.71,14.14 16.52,13.32 16.52,10.89 | R10.1 28.11,14.75 30.54,14.75 R14.1 30.75,14.75 31.56,14.75 | 31.56,14.75 31.97,14.75 | 31.97,14.75 42.13,14.75 R12.1 | 16.52,10.89 17.74,9.67 28.72,9.67 31.56,12.51 31.56,14.75 | JP1.2 125.03,2.76 123.2,4.59 116.9,4.59 115.08,2.76 AR_PRG.1 | R2.2 58.79,22.67 v61.23,22.67 71.79,22.67 73.01,23.89 75.66,23.89 v76.26,23.28 | v65.01,16.58 58.59,16.58 | v132.7,8.52 132.7,9.24 133.16,9.7 133.16,29.51 131.16,31.51 130.28,31.51 128.45,29.68 JP2.2
A  (via drill 0.51)
  Top 0.203: v81.75,5.4 81.75,6.21 87.24,11.7 v87.24,15.36 | 94.35,28.77 95.16,29.58 JP2.15 90.13,24.65 90.13,23.64 95.16,18.61 v95.16,17.79
  Bottom 0.203: v81.75,5.4 81.14,5.4 79.72,3.98 79.72,1.74 78.91,0.93 70.37,0.93 69.56,1.74 69.56,2.96 67.53,4.99 66.18,4.99 63.89,7.28 62.8,7.28 62.45,7.63 47.82,7.63 45.38,5.2 35.83,5.2 34.41,3.77 30.34,3.77 VR3.2 | v87.24,15.36 92.72,15.36 v95.16,17.79
ANT
  Top 0.203: ANT.1 88.66,16.37 U$4.ANT
CH_PD
  Top 0.203: R6.1 120.97,7.23 120.97,7.63 119.55,9.06 119.55,11.7 120.16,12.31 120.16,26.13 120.36,26.33 MDL1.3
CLOCK  (via drill 0.51)
  Top 0.203: v102.88,11.29 103.09,11.5 103.09,17.18 102.88,17.39 102.68,17.39 101.66,18.4 U$4.SCL | v77.89,15.56 77.89,16.78 R15.2 78.09,16.98 79.11,18 79.11,26.3 v81.52,28.72 | U$1.34 71.79,14.14 71.81,14.12 72.63,14.12 72.92,13.83 73.83,13.83 74.11,14.11 v74.64,14.11 | 82.36,15.15 82.36,13.93 24C64.SCL | v81.95,15.56 82.36,15.15 | AR_PRG.6 99.63,5.4 89.68,5.4 89.07,6.01 89.07,14.95 90.08,15.97 90.08,17.18 89.88,17.39 84.6,17.39 82.36,15.15
  Bottom 0.203: v102.88,11.29 102.88,8.65 101.26,7.02 101.26,3.77 AR_PRG.6 | v81.95,15.56 81.14,16.37 78.7,16.37 v77.89,15.56 76.06,15.56 76.06,15.55 76.03,15.58 75.02,15.58 74.64,15.2 v74.64,14.11 | CLOCK.TP 74.28,28.72 v81.52,28.72
DATA  (via drill 0.51, 0.6)
  Top 0.203: v101.46,11.29 101.46,14.54 | 101.46,14.54 101.46,16.37 U$4.SDA | DATA.TP 87.64,29.58 81.34,29.58 74.84,23.08 74.84,17.79 75.66,16.98 R18.2 75.86,16.78 76.26,16.37 v76.26,14.75 | v80.94,15.56 80.94,13.93 24C64.SDA | v96.99,14.54 101.46,14.54 | U$1.35 71.81,14.73 72.76,14.73 72.91,14.59 v73.52,14.59
  Bottom 0.203: v101.46,11.29 101.46,7.84 99.84,6.21 99.84,2.76 AR_PRG.7 | v96.99,14.54 81.95,14.54 v80.94,15.56 78.91,15.56 78.09,14.75 v76.26,14.75 75.35,13.83 75.35,13.82 74.93,13.4 74.34,13.4 73.93,13.82 73.93,14.18 v73.52,14.59
DB4  (via drill 0.6 pad 0.25)
  Top 0.203: U$1.52 68.33,23.14 68.33,23.08 68.31,23.01 68.33,22.99 68.33,22.11 68.78,21.66 71.05,21.66 71.77,22.38 v71.79,27.22 | JP2.11 102.25,26.61 v96.76,26.61 | v86.42,27.04 v88.33,25.72
  Bottom 0.203: 84.6,27.07 84.57,27.04 | v71.79,27.22 84.39,27.22 84.57,27.04 | 84.57,27.04 v86.42,27.04 | v88.33,25.72 95.92,25.72 95.92,25.77 v96.76,26.61
DB5  (via drill 0.51)
  Top 0.203: v82.16,31.82 v75.86,25.52 | U$1.51 68.75,23.08 68.75,22.26 68.95,22.06 70.88,22.06 71.01,22.19 71.01,25.44 v71.06,25.49
  Bottom 0.203: v75.86,25.52 v71.06,25.49 | v82.16,31.82 82.77,31.82 83.38,32.42 100.04,32.42 JP2.12
DB6  (via drill 0.6 pad 0.25)
  Top 0.203: U$1.50 69.22,23.24 69.22,24.04 68.39,24.87 v68.39,25.52 | v96.69,31.64 96.12,31.64 95.74,32.02 88.1,32.02 86.7,30.62 v84.65,30.62
  Bottom 0.203: JP2.13 98.29,31.64 v96.69,31.64 | v84.65,30.62 84.43,30.62 81.82,28.01 69.25,28.01 68.39,27.14 v68.39,25.52
DB7
  Top 0.203: 97.6,30.19 97.6,29.78 JP2.14 97.7,32.32 97.58,32.45 82.53,32.45 82.45,32.53 75.55,32.53 75.45,32.63 74.84,32.02 74.84,30.8 73.57,29.53 71.95,29.53 70.07,27.65 70.07,26.03 69.76,25.73 69.76,23.28 U$1.49
EN  (via drill 0.51)
  Top 0.203: 67.73,23.08 U$1.53 67.73,23.13 67.73,22.33 67.54,22.14 66.82,22.14 66.1,21.43 v66.1,18.81
  Bottom 0.203: v66.1,18.81 78.3,18.81 79.11,18 94.35,18 94.96,18.61 106.54,18.61 109.18,21.25 113.45,21.25 117.92,25.72 117.92,29.58 JP2.6
ESP_GPIO0  (via drill 0.51)
  Top 0.203: v129.91,5.81 129.91,6.82 R5.2 | JP3.1 122.8,3.16 116.5,9.46 116.5,10.28 MDL1.12
  Bottom 0.203: v129.91,5.81 129.91,2.15 128.69,0.93 124.63,0.93 JP3.1
ESP_VCC  (via drill 0.51)
  Top 0.203: v118.94,12.1 118.94,15.76 110.6,24.09 110.6,26.33 MDL1.8
  Bottom 0.203: v118.94,12.1 128.28,2.76 JP1.1
FAV1  (via drill 0.51)
  Top 0.203: 28.11,9.67 28.11,8.04 25.26,5.2 24.24,5.2 22.62,6.82 22.62,19.01 S4.1 | 28.11,9.67 v28.11,11.9 | 28.11,9.67 24.24,9.67 23.43,10.48 23.43,11.5 24.24,12.31 26.28,12.31 36.44,22.47 60.41,22.47 67.73,15.15 71.59,15.15 U$1.36 71.79,15.15 72.61,15.15 v73.22,15.76 | v102.07,6.82 95.57,6.82 92.72,9.67 92.72,14.34 v90.89,16.17
  Bottom 0.203: FAV1.2 FAV1.4 104.71,10.48 104.71,9.46 v102.07,6.82 | v28.11,11.9 R10.2 | v90.89,16.17 82.36,16.17 81.75,16.78 74.23,16.78 v73.22,15.76
FAV1_GATE  (via drill 0.51)
  Top 0.203: v118.33,21.86 118.33,26.33 MDL1.4
  Bottom 0.203: v118.33,21.86 111.01,14.54 111.01,12.92 FAV1.1
FAV2  (via drill 0.6)
  Top 0.203: U$1.31 69.34,11.76 69.34,12.56 69.52,12.74 70.25,12.74 70.56,12.44 72.4,12.44 72.4,10.39 72.71,10.08 72.71,5.63 72.05,4.97 72.05,1.61 71.49,1.06 69.25,1.06 69.02,1.29 v68.75,1.29
  Bottom 0.203: T7.2 123.81,17.79 117.72,17.79 T7.4 117.51,17.59 117.51,16.98 112.23,11.7 106.95,11.7 103.9,14.75 102.88,14.75 98.41,10.28 98.41,7.63 91.3,0.52 68.36,0.52 | 11.04,18 11.04,19.83 9.82,21.05 S5.1 | 11.04,18 11.04,14.54 12.87,12.71 R16.2 | 68.36,0.52 13.88,0.52 5.55,8.85 5.55,14.34 9.21,18 11.04,18 | v68.75,1.29 68.36,0.9 68.36,0.52
FAV2_GATE  (via drill 0.51)
  Top 0.203: v118.33,20.23 112.64,25.92 112.64,26.33 MDL1.7
  Bottom 0.203: v118.33,20.23 123.61,20.23 123.81,20.03 T7.1
FAV3
  Top 0.203: U$1.32 69.76,11.7 69.76,8.04 65.7,3.98 65.7,1.74 65.09,1.13 21.6,1.13 14.29,8.45 12.26,8.45 9.82,10.89 S6.1
  Bottom 0.203: R17.2 15.51,12.51 14.49,12.51 13.07,11.09 9.82,11.09 S6.1
GND  (via drill 0.51, 0.6)
  Top 0.203: AR_PRG.2 110.6,4.59 110.6,10.28 MDL1.9 110.4,10.48 100.65,10.48 97.4,13.73 96.79,13.73 94.35,16.17 94.35,18.81 88.66,24.5 U$4.GND | v110.6,19.01 110.6,23.48 109.59,24.5 109.59,28.77 | 109.59,28.77 110.4,29.58 JP2.9 110.4,29.78 112.84,29.78 JP2.8 113.04,29.78 115.48,29.78 JP2.7 | 109.59,28.77 108.78,29.58 107.96,29.58 JP2.10 | R8.1 136,7.02 136,19.83 S3.1 136,20.03 136,23.89 137.22,25.11 137.22,27.34 136.62,27.95 132.35,27.95 130.72,29.58 JP2.1 130.72,29.78 128.89,31.61 122.39,31.61 120.56,29.78 JP2.5 | C1.2 24.04,31.21 19.98,31.21 C2.2 19.98,31 14.9,25.92 13.07,25.92 AUXJACK.3 12.87,25.72 12.46,25.72 7.38,20.64 | 11.04,5.2 11.04,3.77 R1.1 | S6.3 11.04,5.2 | 11.04,5.2 12.87,7.02 13.88,7.02 Q2.2 | 7.38,20.64 3.52,24.5 BAT-.1 | 7.38,20.64 9.62,18.4 9.62,16.78 S5.3 | PIC_PRG.3 75.86,2.96 75.66,3.16 75.66,6.62 C11.1 75.66,6.82 v76.87,8.04 | 80.94,9.46 81.14,9.67 81.14,11.7 80.12,12.71 80.12,18 24C64.GND 81.14,19.01 82.36,19.01 24C64.A2 82.56,19.01 83.58,19.01 24C64.A1 83.78,19.01 84.8,19.01 24C64.A0 85,19.01 85,21.05 88.46,24.5 U$4.GND | 80.94,9.46 79.72,8.24 79.72,7.02 C12.2 | 80.94,9.46 v82.16,8.24 | S7.3 54.72,16.78 55.13,17.18 U$1.9 60.78,17.18 60.85,17.12 61.57,17.12 62.19,16.5 v62.19,15.51 | 31.15,23.28 33.19,21.25 S8.3 | 31.15,23.28 27.9,26.53 27.9,27.95 R9.1 | 31.15,23.28 31.15,23.08 24.85,16.78 S4.3 24.65,16.58 24.65,13.32 23.03,11.7 23.03,8.24 24.65,6.62 S11.3 | U$1.20 63.83,11.76 63.83,12.56 64.48,13.21 v64.48,13.25 | U$4.GND 88.96,24.5 92.24,27.78 92.24,29.3 JP2.16
  Bottom 0.203: T7.3 123.81,15.36 118.12,15.36 111.01,8.24 FAV1.3 111.01,8.04 111.01,4.18 AR_PRG.2 114.26,0.93 115.48,0.93 117.31,2.76 JP3.2 120.36,2.76 122.59,0.52 128.89,0.52 131.13,2.76 ESP_PRG.3 131.94,2.76 131.94,9.06 132.75,9.87 132.75,27.55 130.72,29.58 JP2.1 | v110.6,19.01 MUTE.3 | JP2.5 120.56,30.19 118.73,32.02 117.31,32.02 115.48,30.19 JP2.7 | S6.3 9.62,6.62 9.62,9.26 8.4,10.48 8.4,12.51 9.62,13.73 9.62,16.58 S5.3 | 82.16,8.04 95.77,8.04 VOLDOWN.3 | 82.16,8.04 PREVIOUS.3 v76.87,8.04 | 82.56,19.62 80.53,19.62 NEXT.3 80.33,19.62 66.92,19.62 66.51,20.03 56.76,20.03 54.72,18 S7.3 54.72,16.58 52.49,14.34 52.08,14.34 52.08,14.35 51.58,14.86 51.58,15.05 47.61,19.01 45.78,19.01 | VOLUP.3 95.97,19.62 97.4,21.05 97.4,22.47 96.79,23.08 91.69,23.08 90.83,23.94 86.88,23.94 82.56,19.62 | v82.16,8.24 82.16,8.04 | 51.07,26.13 50.05,27.14 48.02,27.14 47,26.13 | 51.07,26.13 52.08,25.11 VR4.3 52.29,25.11 60.01,25.11 65.7,30.8 GND.TP | 47,26.13 45.78,24.91 45.78,24.09 C5.1 | 47,26.13 43.75,29.38 VR5.3 | 45.78,19.01 45.78,20.84 51.07,26.13 | 45.78,19.01 C6.1 44.36,19.01 42.94,17.59 41.31,17.59 37.86,21.05 33.39,21.05 S8.3 33.19,21.05 31.76,19.62 27.9,19.62 27.5,20.03 27.5,21.25 27.9,21.66 31.15,21.66 32.58,23.08 34,23.08 34.2,23.28 34.2,26.94 33.59,27.55 32.78,27.55 U$2.GND | R4.1 20.79,14.75 22.62,14.75 R3.1 22.82,14.75 24.65,16.58 S4.3 | S10.3 50.05,6.21 48.22,4.38 42.13,4.38 VR1.3 41.92,4.18 35.42,4.18 33.8,2.55 29.32,2.55 29.12,2.76 29.12,4.79 | 29.12,4.79 27.09,4.79 VR3.3 26.89,4.79 26.48,4.79 24.85,6.42 S11.3 24.65,6.62 23.43,7.84 17.74,7.84 17.13,7.23 14.09,7.23 Q2.2
  Bottom 0.203: 29.12,4.79 33.39,4.79 35.02,6.42 39.69,6.42 S9.3 | v64.48,13.25 64.48,13.83 65.08,14.43 65.08,15.69 64.91,15.86 64.72,15.86 64.62,15.97 62.65,15.97 v62.19,15.51 | JP2.16 90.78,29.68 84.48,23.38 83.02,23.38 82.39,22.75 82.39,19.8 82.56,19.62
IN+(1)
  Bottom 0.203: U$2.IN+(1) 38.67,25.11 41.11,22.67 46.39,22.67 48.83,25.11 48.83,25.92 VR4.2
IN+(2)
  Bottom 0.203: VR5.2 40.3,30.39 38.67,30.39 36.44,28.16 36.44,27.14 37.05,26.53 37.86,26.53 U$2.IN+(2)
IN-(1)
  Bottom 0.203: C6.2 42.13,19.01 42.13,20.64 39.08,23.69 38.06,23.69 U$2.IN-(1)
IN-(2)
  Bottom 0.203: C5.2 41.92,24.09 39.48,26.53 39.48,26.74 38.67,27.55 38.06,27.55 U$2.IN-(2)
INT2
  Top 0.203: 71.79,20.23 U$1.46 71.83,20.25 72.63,20.25 72.81,20.42 72.81,27.55 | 73.11,27.85 72.81,27.55 | 73.11,27.85 INT_PINS.1 | 72.81,27.55 73.11,27.85
INT3
  Top 0.203: U$1.45 71.81,19.74 72.7,19.74 73.22,20.26 73.22,26.51 75.12,28.41 76.21,28.41 INT_PINS.2
L-OUT  (via drill 0.51)
  Top 0.203: C4.2 53.71,30.8 58.38,30.8 60.01,32.42 66.71,32.42 68.14,31 L-OUT.TP | U$4.L-OUT 88.66,20.44 92.11,16.98 92.32,16.98 94.35,14.95 94.35,11.5 95.97,9.87 v97.6,9.87 100.04,9.87 106.13,3.77 106.13,1.54 106.74,0.93 107.96,0.93 109.79,2.76 AR_PRG.3 | v54.72,12.71 v52.29,15.15
  Bottom 0.203: 67.53,30.8 68.14,30.8 L-OUT.TP 63.11,25.83 63.11,25.47 61.53,23.89 54.52,23.89 52.29,21.66 v52.29,15.15 | v54.72,12.71 60.01,12.71 62.65,10.07 65.57,10.07 68.47,7.18 68.47,7.02 97.19,7.02 97.6,7.43 v97.6,9.87
MCLR  (via drill 0.51)
  Top 0.203: v61.43,10.28 61.43,13.15 63.84,15.56 63.84,17.34 62.98,18.2 U$1.7
  Bottom 0.203: 61.84,10.28 v61.43,10.28 62.04,9.67 65.29,9.67 68.06,6.9 68.06,6.86 68.34,6.58 68.34,5.4 70.78,2.96 PIC_PRG.1
MUTE  (via drill 0.51)
  Top 0.203: 53.1,19.22 33.8,19.22 25.67,11.09 24.85,11.09 S11.1 | 53.1,19.22 60.21,19.22 U$1.5 | 53.1,19.22 v53.1,21.45
  Bottom 0.203: MUTE.2 110.6,22.67 104.51,22.67 MUTE.4 104.31,22.67 102.27,22.67 96.38,28.56 96.38,30.8 95.16,32.02 83.58,32.02 82.56,31 80.53,31 78.91,32.63 71.79,32.63 69.76,30.6 69.76,30.39 66.16,26.79 66.16,25.21 64.43,23.48 55.13,23.48 v53.1,21.45 | R14.2 30.54,12.92 30.14,12.92 28.31,11.09 24.85,11.09 S11.1
MUTE_GATE  (via drill 0.51)
  Top 0.203: v115.48,24.91 116.3,25.72 116.3,26.33 MDL1.5
  Bottom 0.203: v115.48,24.91 110.6,24.91 MUTE.1
N$1
  pour Top: 0.01,33.08 0.01,-0.11 139.03,-0.11 139.03,33.14
N$4
  pour Bottom: -0.01,33.16 139,33.16 139,0.01 -0.01,0.01
N$6
  Bottom 0.203: R4.2 20.79,12.92 21.2,12.92 22.21,11.9 23.64,11.9 28.92,17.18 C10.2
N$10  (via drill 0.51)
  Top 0.203: v21.81,8.85 21.81,20.03 25.67,23.89 25.67,27.55 27.09,28.97 28.51,28.97 29.32,28.16 R9.2 | v83.58,11.29 83.58,13.73 24C64.WP | v65.75,8.04 v68.75,8.04
  Bottom 0.203: v21.81,8.85 62.24,8.85 62.57,9.18 64.76,9.18 65.75,8.19 v65.75,8.04 | v68.75,8.04 75.86,8.04 77.08,9.26 81.55,9.26 v83.58,11.29
N$11  (via drill 0.51)
  Top 0.203: v48.83,31.41 49.44,31.41 50.05,30.8 C4.1
  Bottom 0.203: v48.83,31.41 43.75,31.41 VR5.1
N$12  (via drill 0.51)
  Top 0.203: v67.53,27.14 v61.02,27.14 | v74.84,24.7 74.84,23.69 74.44,23.28 74.44,18.4 v74.03,18 | v90.89,17.18 93.94,14.14 93.94,10.68 95.77,8.85 C3.1
  Bottom 0.203: v61.02,27.14 52.29,27.14 VR4.1 | v74.03,18 78.5,18 79.31,17.18 v90.89,17.18 | v67.53,27.14 66.59,26.2 66.59,25.03 66.92,24.7 v74.84,24.7
N$17
  Bottom 0.203: R3.2 22.82,13.12 25.06,15.36 25.26,15.36 26.07,16.17 26.07,17.18 25.26,18 16.73,18 16.12,17.39 C9.2
N$18
  Top 0.203: R1.2 11.04,1.94 7.79,1.94 D1.C
N$20
  Bottom 0.203: SWITCH2.1 4.13,13.32 4.13,15.56 6.36,17.79 6.36,24.5 BAT_5V.1
N$24
  Top 0.203: R8.2 134.38,6.82 136.62,4.59 137.43,4.59 138.04,3.98 138.04,1.54 137.02,0.52 122.8,0.52 121.38,1.94 121.38,3.98 116.5,8.85 113.86,8.85 112.43,10.28 MDL1.10
NEXT
  Top 0.203: U$1.3 60.21,20.23 55.54,20.23 54.72,21.05 S7.1
  Bottom 0.203: S7.1 54.72,21.25 55.94,22.47 56.96,22.47 R2.1 57.16,22.47 57.98,21.66 74.23,21.66 NEXT.4 74.44,21.86 80.33,21.86 NEXT.2
NEXT_GATE  (via drill 0.51)
  Top 0.203: MDL1.6 114.67,26.33 114.67,24.7 115.28,24.09 116.3,24.09 117.51,25.31 117.51,27.75 116.7,28.56 116.7,30.8 115.89,31.61 99.84,31.61 98.82,30.6 98.82,28.36 98.21,27.75 97.19,27.75 96.38,28.56 96.38,30.8 95.57,31.61 91.61,31.61 88.34,28.35 87.2,28.35 87.19,28.36 85.26,28.36 84.85,27.95 84.85,24.75 v84.19,24.09
  Bottom 0.203: NEXT.1 v84.19,24.09
OUT_1
  Top 0.203: AUXJACK.2 13.07,28.36 13.07,30.8 AUXJACK.1
  Bottom 0.203: 26.89,28.36 26.89,28.77 29.32,31.21 OUT1.TP 31.15,31.21 34.61,27.75 34.61,23.08 34.2,22.67 32.98,22.67 31.15,20.84 29.12,20.84 C10.1 | 26.89,28.36 26.89,24.91 C7.2 | 26.89,28.36 13.07,28.36 AUXJACK.2
OUT_2
  Top 0.203: AUXJACK.5 13.07,20.84 13.07,23.08 AUXJACK.4
  Bottom 0.203: C9.1 12.66,17.39 12.66,20.44 12.87,20.64 AUXJACK.5 | C8.2 20.59,24.7 19.37,24.7 17.95,23.28 13.07,23.28 AUXJACK.4
OUTPUT(1)
  Bottom 0.203: U$2.OUTPUT(1) 31.76,22.87 25.67,22.87 23.84,24.7 23.23,24.7 C7.1
OUTPUT(2)
  Bottom 0.203: C8.1 17.34,24.91 18.76,24.91 19.98,26.13 24.04,26.13 25.67,24.5 25.67,23.48 25.87,23.28 28.11,23.28 31.15,26.33 32.58,26.33 U$2.OUTPUT(2)
PGC
  Top 0.203: 72.61,18.2 U$1.42 71.83,18.14 72.63,18.14 72.81,17.96 72.81,17.17 75.45,14.53 75.45,12.51 77.69,10.28 77.69,6.01 80.94,2.76 PIC_PRG.5
PGD  (via drill 0.6 pad 0.25)
  Top 0.203: U$1.37 70.35,15.69 v69.94,16.09 | 71.08,11.41 v71.08,11.47 70.17,10.56 70.17,7.87 69.69,7.39 v69.69,5.3
  Bottom 0.203: 70.12,4.89 69.71,5.3 | 70.12,4.89 70.3,4.71 76.3,4.71 78.13,2.88 PIC_PRG.4 | v69.94,16.09 70.61,15.43 70.61,11.95 v71.08,11.47 | v69.69,5.3 69.71,5.3 | 69.71,5.3 70.12,4.89
PREVIOUS  (via drill 0.6)
  Top 0.203: U$1.4 60.35,19.64 61.15,19.64 61.19,19.6 62.65,19.6 64.3,17.95 64.3,16.28 64.33,16.26 v64.33,14.82
  Bottom 0.203: PREVIOUS.2 80.33,10.48 74.23,10.48 PREVIOUS.4 74.03,10.48 62.85,10.48 61.02,12.31 | S8.1 33.39,16.58 34.61,15.36 40.3,15.36 40.5,15.56 42.94,15.56 43.14,15.36 43.14,14.75 44.77,13.12 R11.1 44.97,13.12 45.38,13.53 59.8,13.53 61.02,12.31 | v64.33,14.82 63.46,14.75 61.02,12.31
PREVIOUS_GATE  (via drill 0.51)
  Top 0.203: v110.2,14.95 110.2,14.75 114.47,10.48 MDL1.11
  Bottom 0.203: v110.2,14.95 104.31,14.95 104.1,15.15 101.87,15.15 98.21,11.5 91.91,11.5 90.89,12.51 80.53,12.51 PREVIOUS.1
R-OUT
  Top 0.203: U$4.R-OUT 88.66,22.47 93.94,17.18 93.94,15.97 95.77,14.14 95.77,12.31 C3.2 95.97,12.1 98.41,12.1 107.35,3.16 AR_PRG.4
REST  (via drill 0.51)
  Top 0.203: v117.31,7.02 116.09,7.02 R7.2 | v121.38,14.54 121.38,23.28 124.42,26.33 MDL1.1 124.63,26.53 124.83,26.74 132.55,26.74 132.96,26.33 135.8,26.33 S3.2
  Bottom 0.203: v117.31,7.02 117.31,11.5 120.36,14.54 v121.38,14.54
RF0  (via drill 0.6)
  Top 0.203: U$1.18 62.8,11.67 62.8,5.88 63.23,5.45 v63.39,5.45
  Bottom 0.203: v63.39,5.45 64.05,4.78 64.11,4.84 65,4.84 66.83,3.01 SPARE.1
RF1
  Top 0.203: U$1.17 62.24,11.7 62.24,5.4 64.48,3.16 SPARE.2
RF2
  Top 0.203: U$1.16 60.41,13.73 60.41,4.59 61.84,3.16 SPARE.3
RF3
  Top 0.203: U$1.15 60.21,14.14 59.4,14.14 59.2,13.93 59.2,3.37 59.4,3.16 SPARE.4
RF4
  Top 0.203: U$1.14 60.22,14.63 59.32,14.63 58.79,14.1 58.79,5.42 56.94,3.57 SPARE.5
RF5
  Top 0.203: U$1.13 60.25,15.14 59.25,15.14 58.36,14.24 58.36,6.11 57.09,4.84 56.49,4.84 54.66,3.01 SPARE.6
RF6
  Top 0.203: U$1.12 60.22,15.62 59.16,15.62 57.95,14.41 57.95,7.68 55.24,4.97 53.81,4.97 SPARE.7
RF7
  Top 0.203: U$1.11 60.21,16.17 58.86,16.17 57.37,14.67 57.37,14.17 56.15,12.95 56.15,9.87 49.44,3.16 SPARE.8
RS  (via drill 0.51)
  Top 0.203: U$1.54 67.32,23.28 67.32,25.8 68.06,26.53 69.15,26.53 v69.36,26.33 | v93.94,26.74 95.31,25.36 105.53,25.36 107.51,27.34 v108.78,27.34
  Bottom 0.203: v69.36,26.33 76.06,26.33 76.87,25.52 86.02,25.52 92.11,31.61 93.13,31.61 93.94,30.8 v93.94,26.74 | v108.78,27.34 113.04,27.34 114.26,28.56 114.26,30.8 115.89,32.42 120.36,32.42 JP2.4
RXD
  Top 0.203: MDL1.15 122.59,10.28 123.41,9.46 123.41,9.26 128.08,4.59 132.55,4.59 134.38,2.76 ESP_PRG.2
TXD
  Top 0.203: 125.03,10.28 124.63,10.28 MDL1.16 125.19,10.31 126.21,9.28 133.01,9.28 133.46,8.84 133.46,8.21 132.6,7.36 132.6,5.73 132.93,5.4 134.33,5.4 | 134.33,5.4 134.79,5.4 136.82,3.37 136.82,2.76 ESP_PRG.1 | 134.33,5.4 134.18,5.4
VDD  (via drill 0.51, 0.6)
  Top 0.203: D1.A 4.74,1.94 4.74,10.89 6.97,13.12 SWITCH1.1 7.18,13.12 9.41,13.12 | 9.41,13.12 11.04,11.5 11.04,11.29 12.66,9.67 Q2.3 | 9.41,13.12 9.41,14.14 19.98,24.7 C2.1 19.98,27.75 24.04,27.75 C1.1 24.24,27.75 25.87,29.38 29.73,29.38 30.95,28.16 v30.95,25.11 32.73,23.33 v51.42,23.33 | U$1.57 65.71,23.24 65.71,24.04 65.53,24.22 63.95,25.8 62.87,25.8 62.85,25.79 v62.36,25.79
  Bottom 0.203: v30.95,25.11 U$2.VDD | v62.36,25.79 61.26,25.79 60.18,24.7 54.06,24.7 52.69,23.33 v51.42,23.33
VO  (via drill 0.51)
  Top 0.203: v68.75,2.35 68.75,3.16 v71.79,6.21 | v89.88,6.21 89.88,10.48 v91.91,12.51
  Bottom 0.203: v68.75,2.35 67.53,1.13 48.83,1.13 46.8,3.16 45.38,3.16 VR1.2 | v89.88,6.21 v71.79,6.21 | v91.91,12.51 93.54,12.51 94.76,13.73 99.23,13.73 103.7,18.2 113.65,18.2 119.55,24.09 123.63,24.09 125.54,26 125.54,29.58 JP2.3
VOLDOWN  (via drill 0.51)
  Top 0.203: v56.96,15.97 56.96,14.34 55.54,12.92 55.54,11.7 54.72,10.89 S10.1 | v67.12,17.79 69.97,20.64 71.59,20.64 U$1.47
  Bottom 0.203: VOLDOWN.2 VOLDOWN.4 85.61,10.28 83.78,12.1 82.16,12.1 81.75,11.7 76.26,11.7 76.06,11.9 75.46,12.5 74.97,12.99 74.04,12.99 72.5,14.53 72.5,16.73 70.88,18.35 67.68,18.35 v67.12,17.79 66.31,16.98 65.83,16.98 63.21,19.6 59.42,19.6 59.4,19.62 57.98,19.62 57.16,18.81 R13.2 56.96,18.61 v56.96,15.97
VOLDOWN_GATE  (via drill 0.51)
  Top 0.203: v111.01,15.76 113.25,15.76 117.51,11.5 117.51,11.29 118.33,10.48 MDL1.13
  Bottom 0.203: v111.01,15.76 101.87,15.76 98.82,12.71 95.97,12.71 VOLDOWN.1
VOLUP  (via drill 0.51)
  Top 0.203: 71.59,21.25 U$1.48 69.91,21.2 67.32,18.61 66.92,18.61 v66.1,17.79 v63.06,20.84 | v54.12,18.4 46.8,11.09 39.89,11.09 S9.1
  Bottom 0.203: R12.2 42.13,12.92 41.72,12.92 39.89,11.09 S9.1 | v66.1,17.79 65.29,18.61 65.29,19.01 65.9,19.62 66.31,19.62 66.71,19.22 78.5,19.22 79.31,18.4 86.22,18.4 89.47,21.66 VOLUP.4 89.68,21.86 95.77,21.86 VOLUP.2 | v54.12,18.4 54.52,18.4 56.96,20.84 v63.06,20.84
VOLUP_GATE  (via drill 0.51)
  Top 0.203: v121.38,24.91 120.56,24.09 120.56,10.48 MDL1.14
  Bottom 0.203: v121.38,24.91 121.38,26.53 119.14,28.77 119.14,31 118.53,31.61 117.51,31.61 116.7,30.8 116.7,25.11 113.25,21.66 106.95,21.66 105.73,20.44 100.04,20.44 96.38,24.09 95.97,24.09 VOLUP.1
W/R  (via drill 0.51)
  Top 0.203: v104.71,12.92 104.71,19.42 101.66,22.47 U$4.W/R
  Bottom 0.203: v104.71,12.92 102.07,12.92 98.82,9.67 98.82,4.18 98.62,3.98 98.62,1.54 99.23,0.93 102.88,0.93 104.71,2.76 AR_PRG.5
(copper drawn outside any net)
  shapes: Top circle x1

### Text on the board
tNames: FM PROJECT / GROUP 14